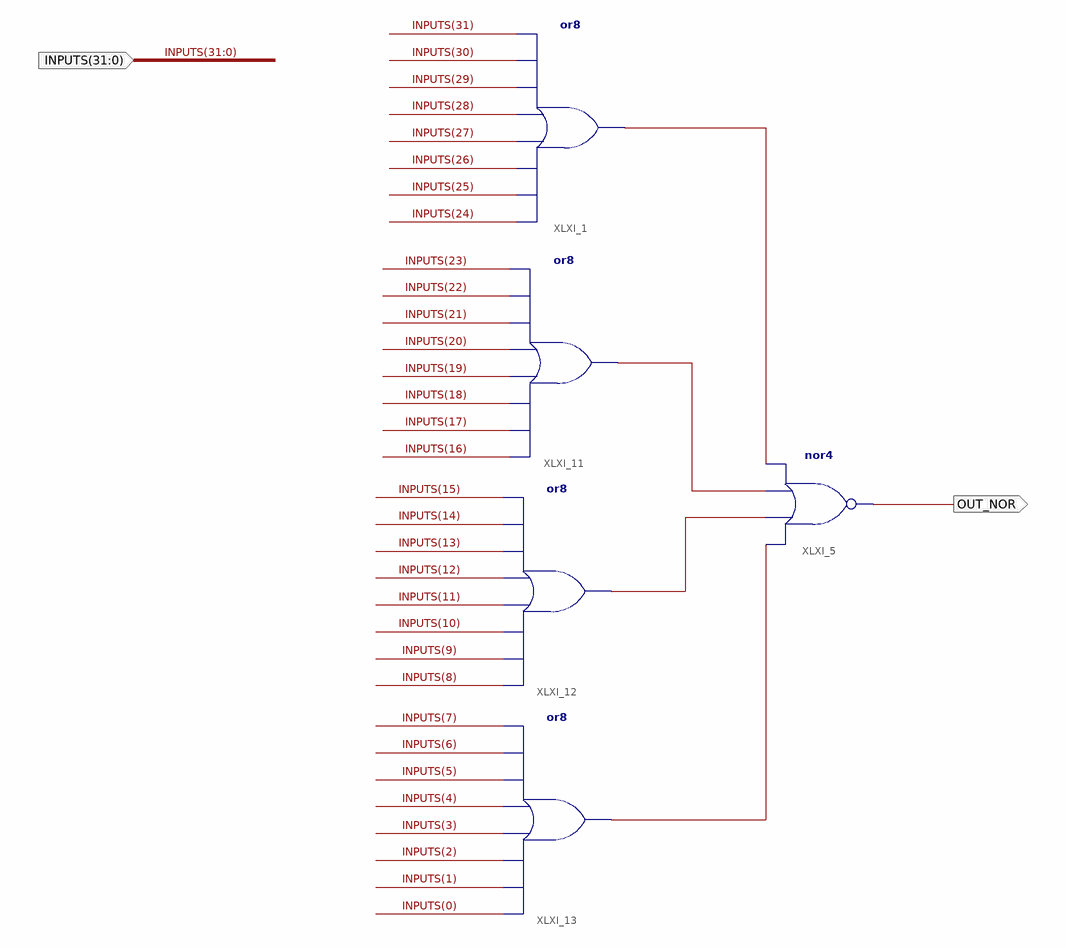
[diagram p0: schematic sheet 1]
// Xilinx ISE schematic NOR_32.sch (artix7) as structural Verilog: 5 symbols, 2 ports
module NOR_32 (
  input  [31:0] INPUTS,
  output OUT_NOR
);

  wire XLXN_2, XLXN_3, XLXN_4, XLXN_5;

  or XLXI_1 (XLXN_2, INPUTS[24], INPUTS[25], INPUTS[26], INPUTS[27], INPUTS[28], INPUTS[29], INPUTS[30], INPUTS[31]);
  nor XLXI_5 (OUT_NOR, XLXN_5, XLXN_4, XLXN_3, XLXN_2);
  or XLXI_11 (XLXN_3, INPUTS[16], INPUTS[17], INPUTS[18], INPUTS[19], INPUTS[20], INPUTS[21], INPUTS[22], INPUTS[23]);
  or XLXI_12 (XLXN_4, INPUTS[8], INPUTS[9], INPUTS[10], INPUTS[11], INPUTS[12], INPUTS[13], INPUTS[14], INPUTS[15]);
  or XLXI_13 (XLXN_5, INPUTS[0], INPUTS[1], INPUTS[2], INPUTS[3], INPUTS[4], INPUTS[5], INPUTS[6], INPUTS[7]);
endmodule
